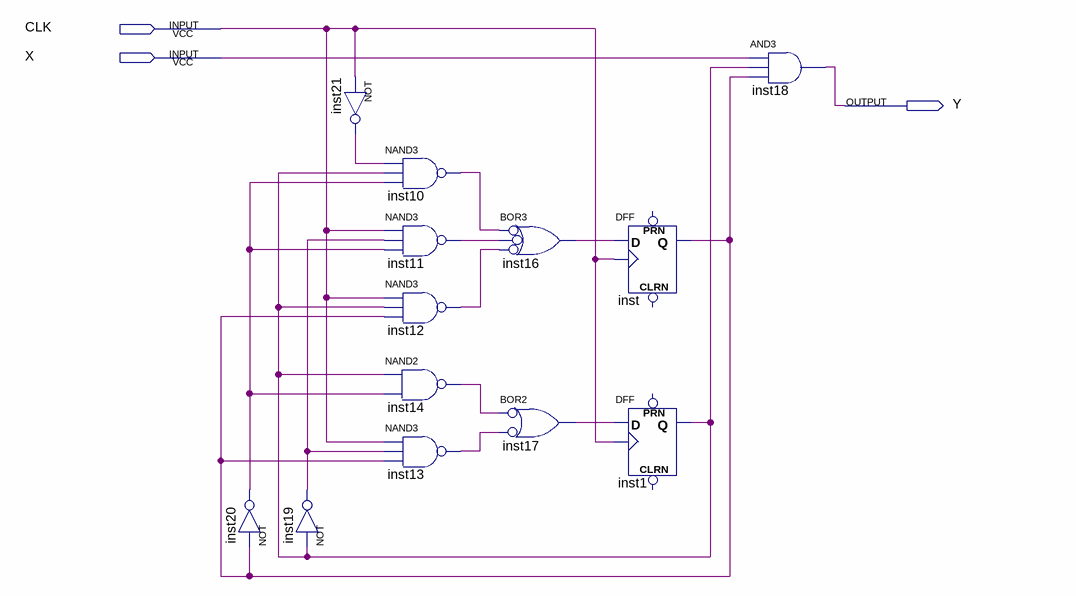
[diagram p0: schematic sheet]
// Quartus schematic SeqDet1101.bdf as structural Verilog: 13 symbols, 3 pins
module SeqDet1101 (
  input  CLK,
  input  X,
  output Y
);

  wire inst1_q, inst10_out, inst11_out, inst12_out, inst13_out, inst14_out, inst16_out, inst17_out,
       inst19_out, inst20_out, inst21_out, inst_q;

  not inst19 (inst19_out, inst1_q);
  not inst20 (inst20_out, inst_q);
  not inst21 (inst21_out, CLK);
  nand inst10 (inst10_out, inst21_out, inst1_q, inst20_out);
  nand inst11 (inst11_out, CLK, inst19_out, inst20_out);
  nand inst12 (inst12_out, CLK, inst1_q, inst_q);
  nand inst14 (inst14_out, inst1_q, inst20_out);
  nand inst13 (inst13_out, CLK, inst19_out, inst_q);
  or inst16 (inst16_out, ~inst10_out, ~inst11_out, ~inst12_out);  // BOR3
  or inst17 (inst17_out, ~inst14_out, ~inst13_out);  // BOR2
  DFF inst (.CLK(CLK), .D(inst16_out), .Q(inst_q));  // open: CLRN, PRN
  DFF inst1 (.CLK(CLK), .D(inst17_out), .Q(inst1_q));  // open: CLRN, PRN
  and inst18 (Y, X, inst1_q, inst_q);
endmodule
